# EAGLE schematic ESP8266 RFID Schematic (EAGLE 9.6.2)
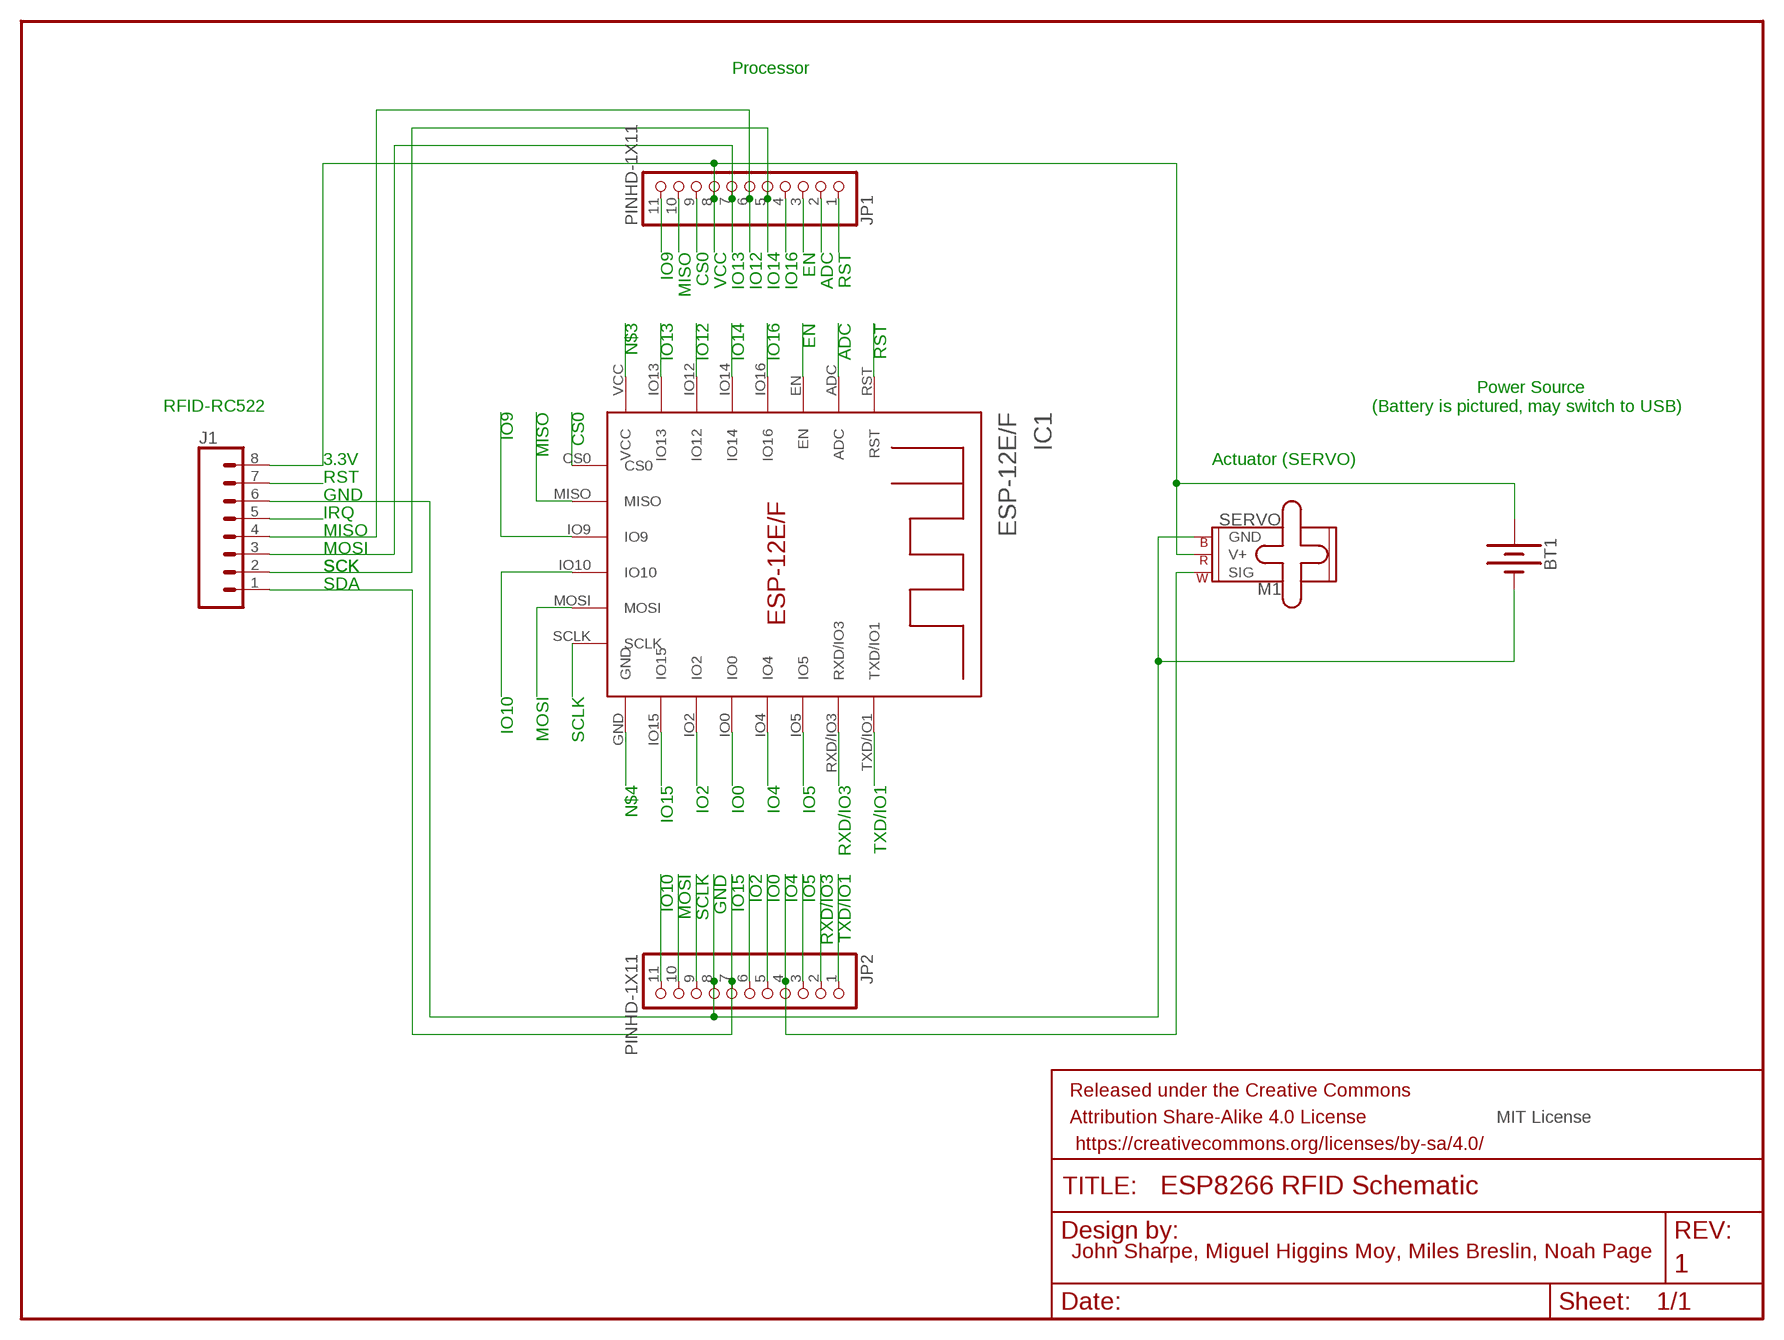
[diagram p0: schematic, sheet 1]

## Parts
BT1  BATTERY-AA  [BATTERY-AA]
FRAME1  FRAME-LETTER  [CREATIVE_COMMONS]
IC1  ESP-12E/F  [ESP-12E]
J1  CONN_08"  [1X08]
JP1  PINHD-1X11  [1X11]
JP2  PINHD-1X11  [1X11]
M1  SERVO  [1X03]

## Nets
ADC: IC1.ADC JP1.2
CS0: IC1.CS0 JP1.9
EN: IC1.EN JP1.3
GND: BT1.GND@1(-) J1.6 JP2.8 M1.3(GND)
IO0: IC1.IO0 JP2.5
IO2: IC1.IO2 JP2.6
IO4: IC1.IO4 JP2.4 M1.1(SIG)
IO5: IC1.IO5 JP2.3
IO9: IC1.IO9 JP1.11
IO10: IC1.IO10 JP2.11
IO12: J1.4 JP1.6
IO13: IC1.IO13 J1.3 JP1.7
IO14: J1.2 JP1.5
IO15: J1.1 JP2.7
IO16: IC1.IO16 JP1.4
IRQ: J1.5
MISO: IC1.MISO JP1.10
MOSI: IC1.MOSI JP2.10
N$1: IC1.IO14
N$2: IC1.IO12
N$3: IC1.VCC
N$4: IC1.GND
N$5: IC1.IO15
RST: IC1.RST J1.7 JP1.1
RXD/IO3: IC1.RXD/IO3 JP2.2
SCLK: IC1.SCLK JP2.9
TXD/IO1: IC1.TXD/IO1 JP2.1
VCC: BT1.PWR@1(+) J1.8 JP1.8 M1.2(V+)

## Notes on the sheet
- Processor
- RFID-RC522
- Power Source 
  (Battery is pictured, may switch to USB)
- 3.3V | Actuator (SERVO)
- RST
- GND
- IRQ
- MISO
- MOSI
- SCK | SCK
- SDA

## Library data of the parts
BT1 = SparkFun-Batteries:BATTERY: Battery - Single Cell A variety of battery chemistries, sizes, and footprints. Device List: 20MM_PTH - Coin Cell Battery Holder - 20mm (PTH) <https://www.sparkfun.com/products/783> 20MM_PTH_KIT- Coin Cell battery Holder - 20 mm (PTH) <http://www.sparkfun.com/products/783>kit version with special mask 6.8MM_PTH - Coin Cell Battery Holder - 6.8MM(SMD) <https://www.digikey.com/product-detail/en/seiko-instruments/MS621FE-FL11E/728-1057-ND/1889208?WT.srch=1&gclid=CNOQ5a6LzdQCFZS2wAodXCkE0g> 12MM_SMD - Coin Cell Battery Holder - 12mm (SMD) <https://www.sparkfun.com/products/10592> 12MM_PTH - Coin Cell Battery Holder - 12mm (PTH) <https://www.sparkfun.com/products/7948> 20MM_SMD - 20mm Coin Cell Battery Holder (SMD) (2 legs) Used on the Big Time Watch Kit <https://www.sparkfun.com/products/11734> 20MM_SMD_4LEGS - Coin Cell Battery Holder - 20mm (SMD) <https://www.sparkfun.com/products/11892> 20MM_SMD_4LEGS_OVERPASTE - Coin Cell Battery Holder - 20mm (SMD) <https://www.sparkfun.com/products/11892> (Over-paste on the legs) 24.5MM_PTH - Coin Cell Battery Holder - 24.5mm (PTH) <https://www.sparkfun.com/products/8863> 9V - 9V Battery Holder - PC Mount Used on the SparkFun SparkPunk Sound Kit <https://www.sparkfun.com/products/11177> and SparkFun SparkPunk Sequencer Kit <https://www.sparkfun.com/products/12707> 18650 - Battery Holder - 18650 (PTH) <https://www.sparkfun.com/products/13113> AA - Battery Holder - 1xAA (PTH) <https://www.sparkfun.com/products/7949> AAA - Battery Holder - 1xAAA (PTH) <https://www.sparkfun.com/products/12718> AA_KIT - Battery Holder - 1xAA (PTH) <https://www.sparkfun.com/products/7949> Special kit package - pads only have exposed copper on one side of the board. AAA_KIT - Battery Holder - 1xAAA (PTH) <https://www.sparkfun.com/products/12718> Special kit package - pads only have exposed copper on one side of the board.; PROD_ID: BATT-08316; SF_SKU: PRT-07949
FRAME1 = SparkFun-Aesthetics:FRAME-LETTER: Schematic Frame - Letter Standard 8.5x11 US Letter frame; DESIGNER: John Sharpe, Miguel Higgins Moy, Miles Breslin, Noah Page; LICENSE: MIT License; REV: 1
IC1 = esp-12e-f:ESP-12E/F
J1 = SparkFun-Connectors:CONN_08: Multi connection point. Often used as Generic Header-pin footprint for 0.1 inch spaced/style header connections On any of the 0.1 inch spaced packages, you can populate with these: Break Away Headers - Straight <https://www.sparkfun.com/products/116> (PRT-00116) Break Away Male Headers - Right Angle <https://www.sparkfun.com/products/553> (PRT-00553) Female Headers <https://www.sparkfun.com/products/115> (PRT-00115) Break Away Headers - Machine Pin <https://www.sparkfun.com/products/117> (PRT-00117) Break Away Female Headers - Swiss Machine Pin <https://www.sparkfun.com/products/743> (PRT-00743) Arduino Stackable Header - 8 Pin <https://www.sparkfun.com/products/9279> (PRT-09279) For SCREWTERMINALS and SPRING TERMINALS visit here: Screw Terimnals on SparkFun.com <https://www.sparkfun.com/search/results?term=Screw+Terminals> (5mm/3.5mm/2.54mm spacing) This device is also useful as a general connection point to wire up your design to another part of your project. Our various solder wires solder well into these plated through hole pads. Hook-Up Wire - Assortment (Stranded, 22 AWG) <https://www.sparkfun.com/products/11375> (PRT-11375) Hook-Up Wire - Assortment (Solid Core, 22 AWG) <https://www.sparkfun.com/products/11367> (PRT-11367) View the entire wire category on our website here <https://www.sparkfun.com/categories/141> Special notes: Molex polarized connector foot print use with SKU : PRT-08231 with associated crimp pins and housings. 1MM SMD Version SKU: PRT-10208 NOTES ON THE VARIANTS LOCK and LOCK_LONGPADS... This footprint was designed to help hold the alignment of a through-hole component (i.e. 6-pin header) while soldering it into place. You may notice that each hole has been shifted either up or down by 0.005 of an inch from it's more standard position (which is a perfectly straight line). This slight alteration caused the pins (the squares in the middle) to touch the edges of the holes. Because they are alternating, it causes a "brace" to hold the component in place. 0.005 has proven to be the perfect amount of "off-center" position when using our standard breakaway headers. Although looks a little odd when you look at the bare footprint, once you have a header in there, the alteration is very hard to notice. Also,if you push a header all the way into place, it is covered up entirely on the bottom side.; PROD_ID: CONN-08438
JP1 JP2 = Connector:PINHD-1X11: PIN HEADER; CATEGORY: CONNECTOR; SUB-CATEGORY: PIN-HEADER
M1 = SparkFun-Electromechanical:SERVO: Servo Motor 3-pin connector for a standard servo motor (voltage supply, ground, and control signal.) SparkFun Products Servo - Generic (Sub-Micro Size) <https://www.sparkfun.com/products/9065> (ROB-09065) Servo - Generic High Torque Continuous Rotation (Standard Size) <https://www.sparkfun.com/products/9347> (ROB-09347) Servo - Generic High Torque (Standard Size) <https://www.sparkfun.com/products/11965> (ROB-11965)